# Altium schematic sheet Schematic-LAPTOP-LCPH0ON0.SchDoc
size A4; SheetNumber: 1; SheetTotal: 1; SPICEModelCacheMBCRCAUM: <root> / <DocumentId>MBCRCAUM</DocumentId> / <CacheFrame Number="0"> / <Model Name="hmk325b7104_f-t" Kind="CKT"> / <Text>* HMK325B7104_F-T     SPICE MODEL  ( General Type ) / *-------------------------------------------------------------------------------------------------------- / * Model Generated by TAIYO YUDEN Corporation (http://www.ty-top.com) / * Version 1.0 / * TAIYO YUDEN Control No. 170508_141201 / * Copyright(c) 2012 TAIYO YUDEN CO.,LTD. All Rights Reserved. / *-------------------------------------------------------------------------------------------------------- / * / * Products Name : Multilayer Ceramic Capacitors / * / * Characteristics : / *     Capacitance : 0.1 uF , Rated Voltage : 100V , TCC : X7R / *     Case Size : 3.2 x 2.5 / 0.126 x 0.098 [mm/inch] , Thickness : 1.15 / 0.045 [mm/inch] / *     (Conditions: Temperature = 25 degC , DC Bias Current/Voltage = 0A / 0V) / * / * Frequency Range : 40Hz - 3GHz / * / * External Node Assignments : / * / *  1  o---| |---o  2 / * / *-------------------------------------------------------------------------------------------------------- / .SubCkt HMK325B7104_F-T 1 2 / **************************** / C0 1 110 0.095532u / Cm 1 101 3805.3p / C1 101 102 0.01509u / Rc1 101 102 40.975k / C2 102 103 6778.9p / Rc2 102 103 1.4176k / C3 103 110 260.41p / Rc3 103 110 79.961 / C2m 1 301 4568.3p / C21 301 302 0.071802u / Rc21 301 302 464.01k / C22 302 303 0.035333u / Rc22 302 303 225.92k / C23 303 304 0.028902u / Rc23 303 304 133.76k / C24 304 305 0.047878u / Rc24 304 305 4.1251k / C25 305 306 0.015636u / Rc25 305 306 5.479k / C26 306 307 0.014659u / Rc26 306 307 3.178k / C27 307 308 2801.3p / Rc27 307 308 295.68 / C28 308 309 4017.6p / Rc28 308 309 104.46 / C29 309 110 83.562p / Rc29 309 110 42.558 / Rp0 1 110 1G / L0 110 120 0.27334n / Lm 120 130 0.16718n / RL1 120 130 160.7 / L2 120 122 0.48212n / RL2 122 130 0.3424 / L3 120 123 0.63819n / RL3 123 130 0.51263 / CR 120 124 0.013671u / LR 124 125 0.13344n / RR 125 130 0.13337 / CL 130 140 11.279p / LL 130 140 0.20244n / RL 130 140 8.6247 / Rs 140 2 15.189m / **************************** / .ends HMK325B7104_F-T</Text> / </Model> / </CacheFrame> / </root>
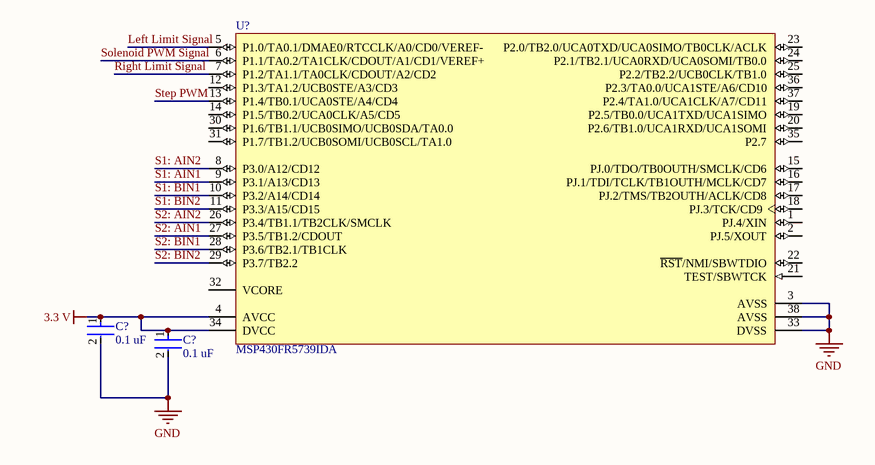
[diagram p0: Schematic-LAPTOP-LCPH0ON0.SchDoc]

## Parts
(Parts that share a designator on the sheet are numbered #1, #2 ... from top to bottom, then left to right.)
C?#1  0.1 uF  [FP-1210-L_3_2_0_3-W_2_5_0-MFG]
C?#2  0.1 uF  [FP-1210-L_3_2_0_3-W_2_5_0-MFG]
U?  MSP430FR5739IDA  [TI-DA38_N]

## Nets
3.3 V: C?#1.1 C?#2.1 U?.4(AVCC) U?.34(DVCC)
GND: C?#1.2 C?#2.2 U?.3(AVSS) U?.33(DVSS) U?.38(AVSS)
Left Limit Signal: U?.5(P1.0/TA0.1/DMAE0/RTCCLK/A0/CD0/VEREF-)
Right Limit Signal: U?.7(P1.2/TA1.1/TA0CLK/CDOUT/A2/CD2)
S1: AIN1: U?.9(P3.1/A13/CD13)
S1: AIN2: U?.8(P3.0/A12/CD12)
S1: BIN1: U?.10(P3.2/A14/CD14)
S1: BIN2: U?.11(P3.3/A15/CD15)
S2: AIN1: U?.27(P3.5/TB1.2/CDOUT)
S2: AIN2: U?.26(P3.4/TB1.1/TB2CLK/SMCLK)
S2: BIN1: U?.28(P3.6/TB2.1/TB1CLK)
S2: BIN2: U?.29(P3.7/TB2.2)
Solenoid PWM Signal: U?.6(P1.1/TA0.2/TA1CLK/CDOUT/A1/CD1/VEREF+)
Step PWM: U?.13(P1.4/TB0.1/UCA0STE/A4/CD4)

Not connected (* = marked no-connect by the designer): U? 1(PJ.4/XIN) 2(PJ.5/XOUT) 12(P1.3/TA1.2/UCB0STE/A3/CD3) 14(P1.5/TB0.2/UCA0CLK/A5/CD5) 15(PJ.0/TDO/TB0OUTH/SMCLK/CD6) 16(PJ.1/TDI/TCLK/TB1OUTH/MCLK/CD7) 17(PJ.2/TMS/TB2OUTH/ACLK/CD8) 18(PJ.3/TCK/CD9) 19(P2.5/TB0.0/UCA1TXD/UCA1SIMO) 20(P2.6/TB1.0/UCA1RXD/UCA1SOMI) 21(TEST/SBWTCK) 22(~{RST}/NMI/SBWTDIO) 23(P2.0/TB2.0/UCA0TXD/UCA0SIMO/TB0CLK/ACLK) 24(P2.1/TB2.1/UCA0RXD/UCA0SOMI/TB0.0) 25(P2.2/TB2.2/UCB0CLK/TB1.0) 30(P1.6/TB1.1/UCB0SIMO/UCB0SDA/TA0.0) 31(P1.7/TB1.2/UCB0SOMI/UCB0SCL/TA1.0) 32(VCORE) 35(P2.7) 36(P2.3/TA0.0/UCA1STE/A6/CD10) 37(P2.4/TA1.0/UCA1CLK/A7/CD11)

## Library data of the parts
C?#1 C?#2 = CMP-14477-003861-2: None; Tolerance: 20%; Voltage Rating: 100V; Dielectric Material: Ceramic; Dielectric: X7R; Capacitance: 100nF; RoHS Compliant: Yes; Height: 1.15mm; Halogen Free: Halogen Free; Case Code (Imperial): 1210; Depth: 2.5mm; Number of Pins: 2; Case/Package: 1210; Termination: SMD/SMT; Packaging: Tape and Reel; Radiation Hardening: No; Min Operating Temperature: -55°C; Construction: Flat; Series: M; Thickness: 0.049inch; Max Operating Temperature: 125°C; Voltage Rating (DC): 100V; Length: 0.126inch; Width: 0.098inch; Package Quantity: 2000; Resistor Type: Ceramic; Case Code (Metric): 3225; Mount: Surface Mount
U? = CMP-0365-00023-1: 24 MHz Mixed Signal Microcontroller, 1024 B SRAM and 33 GPIOs, -40 to 85 degC, 38-pin SOP (DA), Green (RoHS & no Sb/Br); Manufacturer: Texas Instruments; Multiplier: 32x32; USCI_B (I2C & SPI): 1; Timers - 16-bit: 5; ADC: 10-bit SAR; FRAM(KB): 16; DMA: 3; Brown Out Reset: Yes; SRAM(B): 1024; Frequency(MHz): 24; ADC Channels: 14; GPIO: 33; SubFamily: FRAM Series; USCI_A (UART/LIN/IrDA/SPI): 2; Eco-Plan: Green (RoHS & no Sb/Br); ComponentLink2URL: http://www.ti.com/general/docs/lit/getliterature.tsp?genericPartNumber=MSP430FR5739&fileType=pdf; ComponentLink1URL: http://www.ti.com/; ComponentLink1Description: Manufacturer URL; ComponentLink3URL: http://www.ti.com/lit/ml/mtss002e/mtss002e.pdf; PartNumber: MSP430FR5739IDA; ComponentLink2Description: Datasheet; Mounting Technology: Surface Mount; PackageReference: DA38; DatasheetVersion: SLAS639D; Comparators: Yes; PackageVersion: 4040066/F; Code_JEDEC: MO-153; PackageDescription: 38-Pin Plastic Small-Outline Package, Body 6.10 x 12.50 mm, Pitch 0.65 mm; ComponentLink3Description: Package Specification; SVS: Yes; Real-Time Clock: Yes; Watchdog: Yes